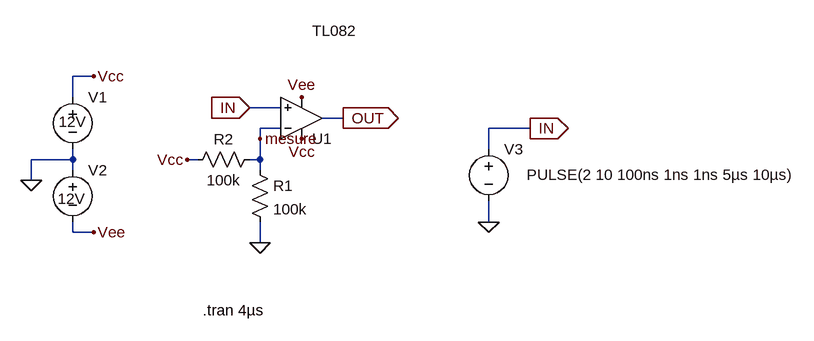
[diagram p0: schematic simple-2.asc]
* simple-2.asc
* U1: TL082 (symbol OpAmp.Add\TL082 not available, pins judged from their places): In+=IN In-=mesure V+=Vcc V-=Vee OUT=OUT
R1 mesure 0 100k
R2 mesure Vcc 100k
V1 Vcc 0 12V
V2 0 Vee 12V
V3 IN 0 PULSE(2 10 100ns 1ns 1ns 5µs 10µs) AC 1
.tran 4µs
.backanno
.end

* Results of the author's LTspice run, read from the files saved beside the schematic
* Operating Point, zero values left out:
*   V(mesure) = 6 V
*   V(in) = 2 V
*   V(vcc) = 12 V
*   V(vee) = -12 V
*   V(out) = -10.59 V
*   I(R2) = -60 µA
*   I(R1) = 60 µA
*   I(V3) = 31.25 µA
*   I(V2) = -633.9 µA
*   I(V1) = -725.1 µA
*   Ix(u1:1) = -31.25 µA
*   Ix(u1:2) = 148.6 pA
*   Ix(u1:99) = 665.1 µA
*   Ix(u1:50) = -633.9 µA
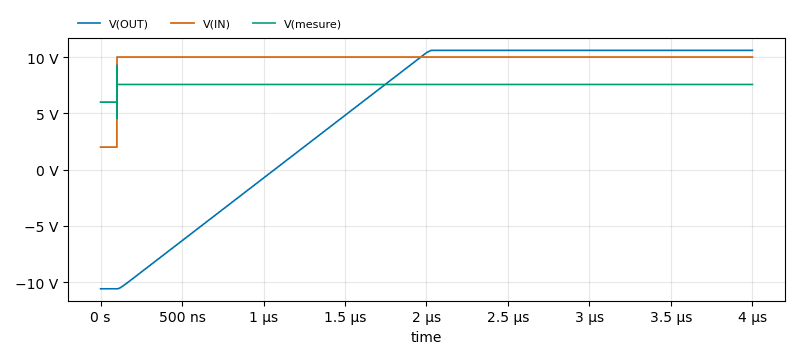
[diagram p1: Transient Analysis of simple-2.asc, plotted from the saved traces]
* Transient Analysis, 1 run:
*   V(OUT): min -10.59 V, max 10.59 V, average 4.939 V, rms 9.233 V, last 10.59 V
*   V(IN): min 2 V, max 10 V, average 9.799 V, rms 9.879 V, last 10 V
*   V(mesure): min 4.534 V, max 9.276 V, average 7.523 V, rms 7.527 V, last 7.563 V